# Altium schematic sheet 3_RF.SchDoc
size 420 x 297 mm; SheetNumber: 3; SheetTotal: 3; Rozrobyv: Іванченко; Pereviryv: {Перевірив}; Tkontr: {Т.контр}; Nkontr: {Н. контр.}; Zatverdyv: {Затвердив}; Oboznachennia: РІ91.468789.001 Е3; Naymenuvannya: Генератор прямого; Naymenuvannya2: цифрового синтезу; MisceVudannya: НТУУ КПІ, РТФ, РІ91; Naymenuvannya3: Схема електрична принципова; Sheet: 3
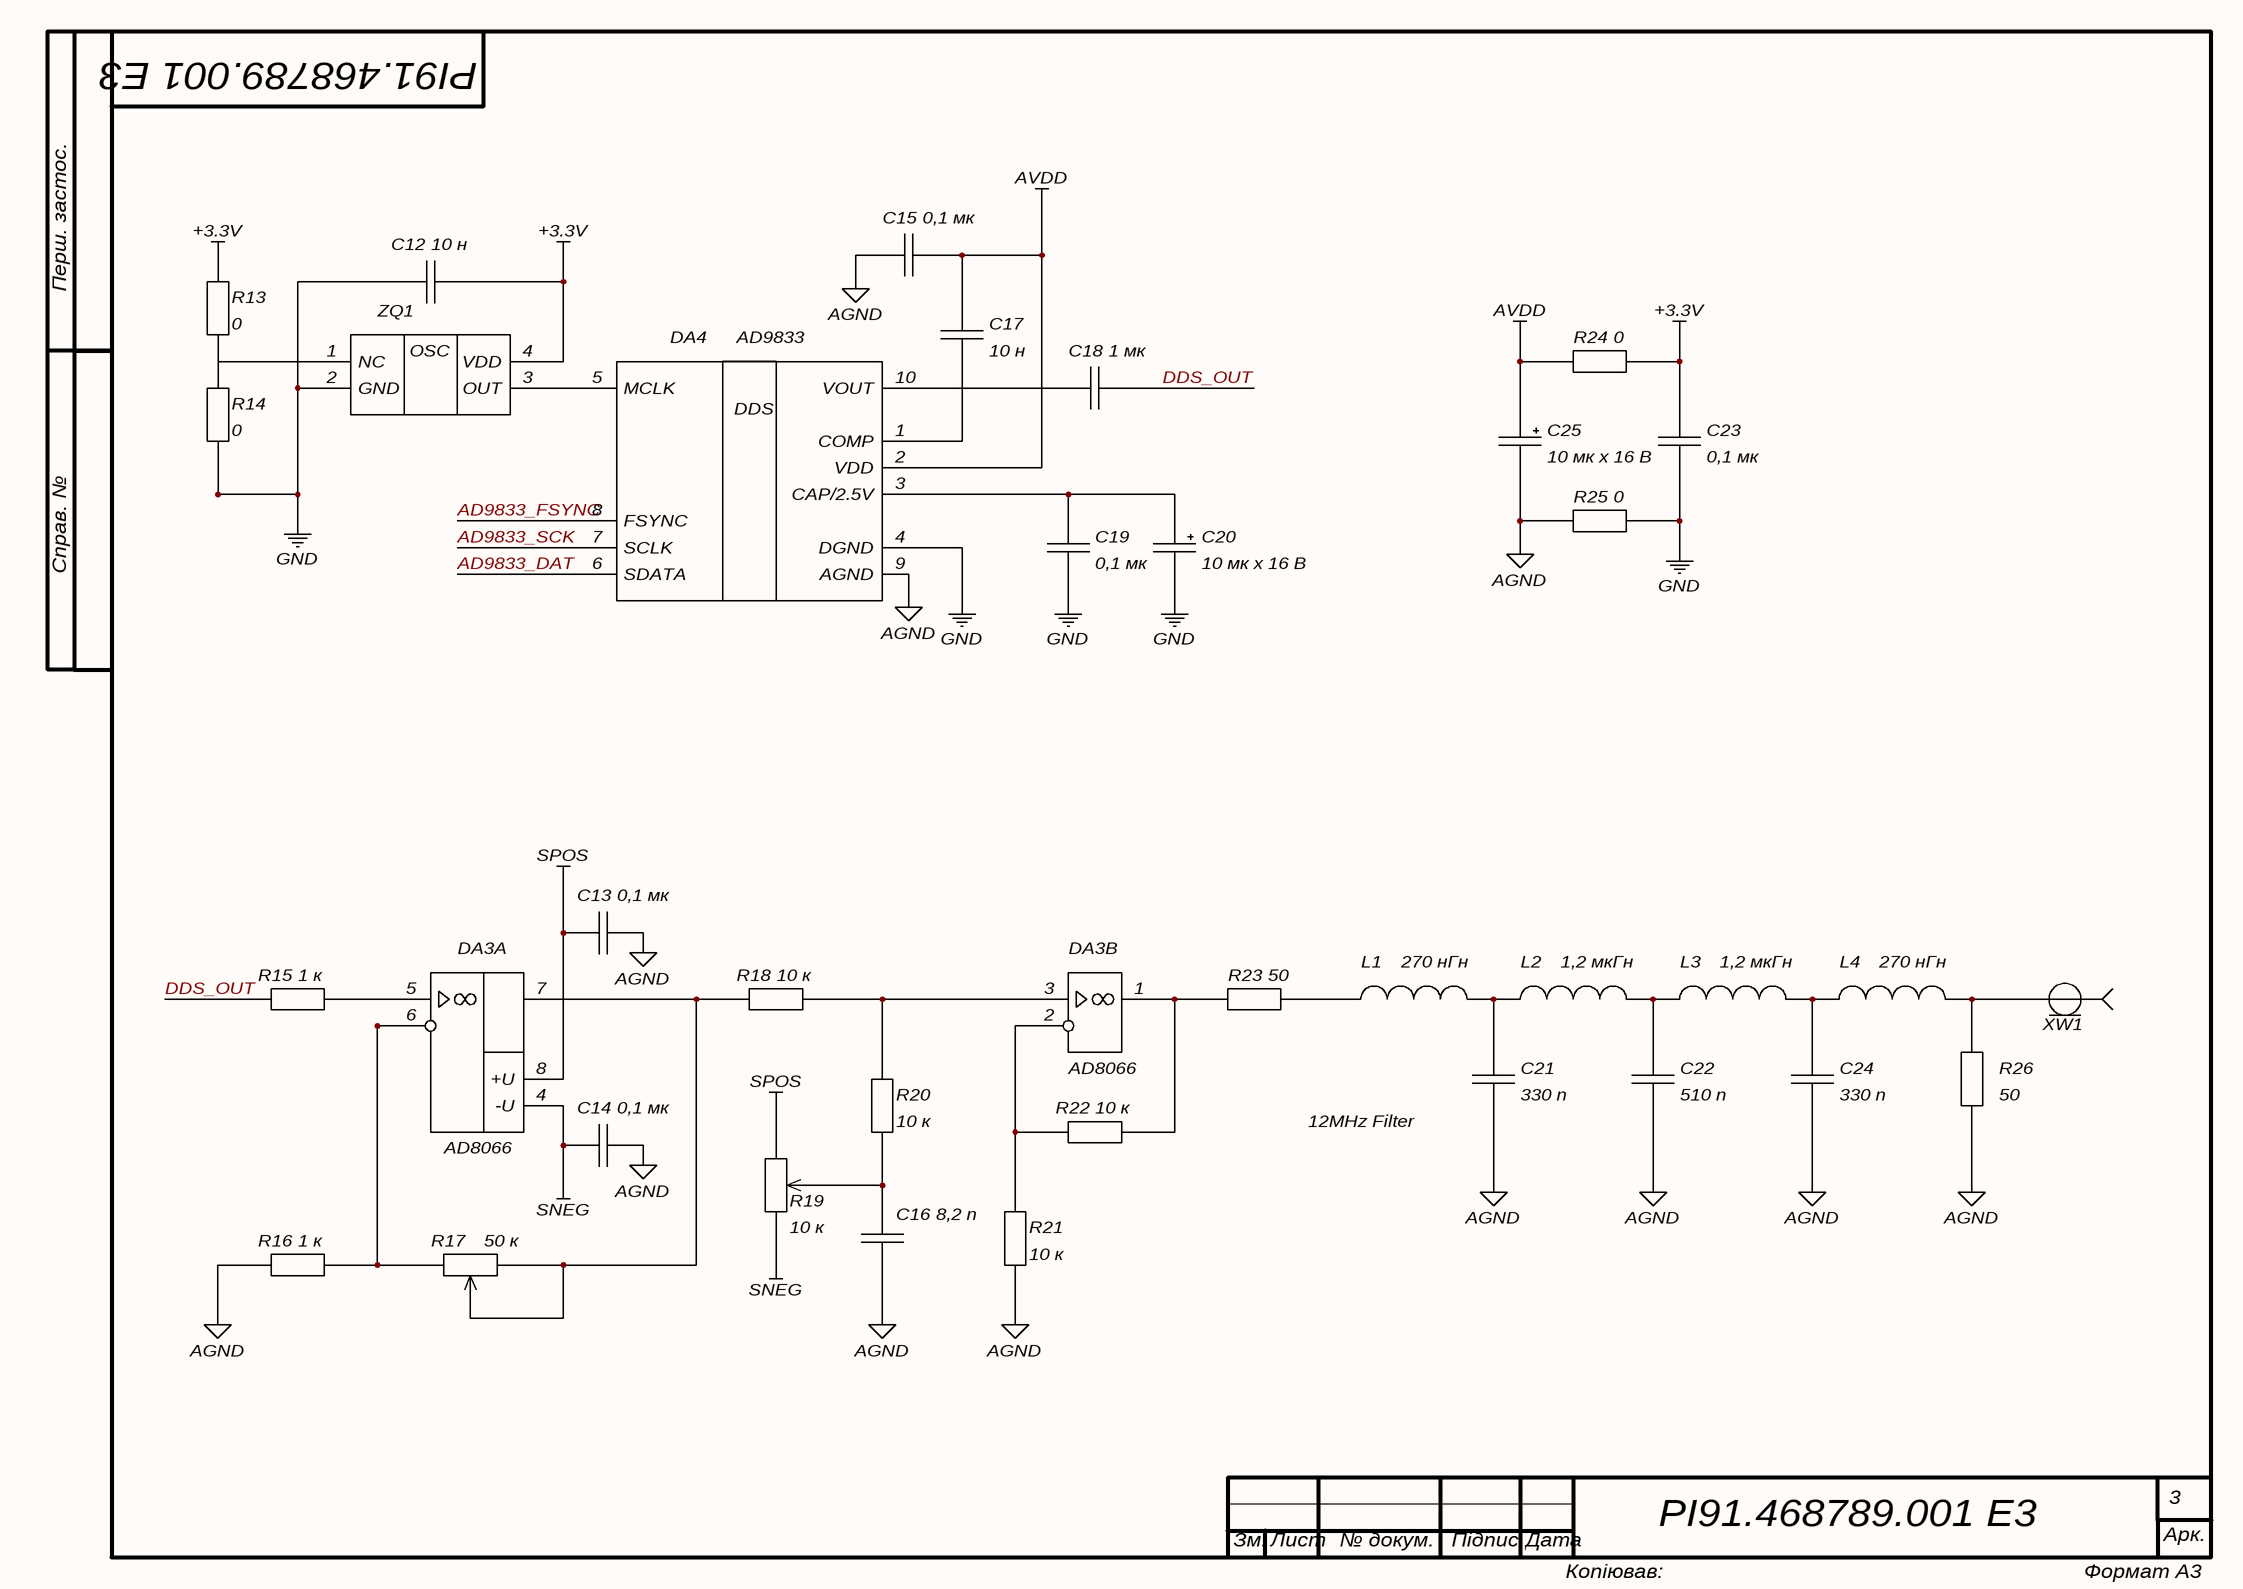
[diagram p0: 3_RF.SchDoc]

## Parts
C12  10n  [CAP: 0603]  (value not drawn)
C13  0.1u  [CAP: 0603]  (value not drawn)
C14  0.1u  [CAP: 0603]  (value not drawn)
C15  0.1u  [CAP: 0603]  (value not drawn)
C16  8.2p  [CAP: 0603]  (value not drawn)
C17  10n  [CAP: 0603]  (value not drawn)
C18  1u 50V  [CAP: 0805]  (value not drawn)
C19  0.1u  [CAP: 0603]  (value not drawn)
C20  10 16: 10 мк х 16 В  [CAP: TANTAL-A]  (hidden comment: 10u 16V)
C21  330p  [CAP: 0805]  (value not drawn)
C22  510p  [CAP: 0805]  (value not drawn)
C23  0.1u  [CAP: 0603]  (value not drawn)
C24  330p  [CAP: 0805]  (value not drawn)
C25  10 16: 10 мк х 16 В  [CAP: TANTAL-A]  (hidden comment: 10u 16V)
DA3  AD8066  [8-SOIC]  (parts A,B of 2)
DA4  AD9833  [10-MSOP]
L1  270n: 270 нГн  [IND: 0805]  (hidden comment: 270nH)
L2  1.2: 1,2 мкГн  [IND: 0805]  (hidden comment: 1.2uH)
L3  1.2: 1,2 мкГн  [IND: 0805]  (hidden comment: 1.2uH)
L4  270n: 270 нГн  [IND: 0805]  (hidden comment: 270nH)
R13  0  [RES: 0603]
R14  0  [RES: 0603]
R15  1k  [RES: 0805]  (value not drawn)
R16  1k  [RES: 0805]  (value not drawn)
R17  50: 50 к  [RES: PTV09A-4015F]  (hidden comment: 10k)
R18  10k  [RES: 0805]  (value not drawn)
R19  10: 10 к  [RES: PTV09A-4015F]  (hidden comment: 10k)
R20  10k  [RES: 0805]  (value not drawn)
R21  10k  [RES: 0805]  (value not drawn)
R22  10k  [RES: 0805]  (value not drawn)
R23  50  [RES: 0805]
R24  0  [RES: 0603]  (net tie, no BOM)
R25  0  [RES: 0603]  (net tie, no BOM)
R26  50  [RES: 0805]
XW1  SMA Edge  [CON: SMA EDGE MOUNT]  (value not drawn)
ZQ1  25 MHz  [OSC: 5070G]  (value not drawn)

## Nets
+3.3V: C12.2 C23.2 R13.2 R24.1 ZQ1.4(VDD)
AGND: C13.2 C14.2 C15.2 C16.1 C21.1 C22.1 C24.1 C25.2 DA4.9(AGND) R16.1 R21.1 R25.2 R26.1
AVDD: C15.1 C17.1 C25.1 DA4.2(VDD) R24.2
GND: C12.1 C19.1 C20.2 C23.1 DA4.4(DGND) R14.1 R25.1 ZQ1.2(GND)
SNEG: C14.1 DA3.4(-U) R19.3
SPOS: C13.1 DA3.8(+U) R19.1
AD9833_DAT: DA4.6(SDATA)
AD9833_FSYNC: DA4.8(FSYNC)
AD9833_SCK: DA4.7(SCLK)
DDS_OUT: C18.2 R15.1
NetC16_2: C16.2 R19.2 R20.1
NetC17_2: C17.2 DA4.1(COMP)
NetC18_1: C18.1 DA4.10(VOUT)
NetC19_2: C19.2 C20.1 DA4.3(CAP/2.5V)
NetC21_2: C21.2 L1.2 L2.1
NetC22_2: C22.2 L2.2 L3.1
NetC24_2: C24.2 L3.2 L4.1
NetDA3_1: DA3.1(OUT2) R22.1 R23.2
NetDA3_2: DA3.2(-IN2) R21.2 R22.2
NetDA3_3: DA3.3(+IN2) R18.2 R20.2
NetDA3_5: DA3.5(+IN1) R15.2
NetDA3_6: DA3.6(-IN1) R16.2 R17.3
NetDA3_7: DA3.7(OUT1) R17.1 R17.2 R18.1
NetDA4_5: DA4.5(MCLK) ZQ1.3(OUT)
NetL1_1: L1.1 R23.1
NetL4_2: L4.2 R26.2 XW1.1(SIG)
NetR13_1: R13.1 R14.2 ZQ1.1(NC)

## Notes on the sheet
- 12MHz Filter
- Перш. застос.
- Справ. №
- Арк.
- Зм.
- Лист
- № докум.
- Підпис
- Дата
- Копіював:
- Формат А3
- (in symbol AD9833) DDS
- (in symbol Oscillator) OSC

## Library data of the parts
C12-C19 C21-C24 = Capacitor: Non-polarity; 1 мк: 1 мк; 100 н: 100 н; 470 н: 470 н; 8,2 п: 8,2 п; 0,1 мк: 0,1 мк; 10 н: 10 н; 180 п: 180 п; 300 п: 300 п; 330 п: 330 п; 510 п: 510 п; 270 п: 270 п
C20 C25 = Capacitor_polar: Polarity; 470 6,3: 470 мк х 6,3 В; 2200 35: 2200 мк x 35 В; 100 16: 100 мк х 16 В; 0.1 400: 0,1 мк х 400 В; 2.2 16: 2,2 мк х 16 В; 1 16: 1 мк х 16 В; 47 50: 47 мк х 50 В; 47 10: 47 мк х 10 В
DA3 = Op Amp: ComponentLink1Description: Datasheet; ComponentLink1URL: https://www.analog.com/media/en/technical-documentation/data-sheets/AD8065_8066.pdf; LM358: LM358; AD8066: AD8066
DA4 = AD9833: DDS Generator; ComponentLink1Description: Datasheet; ComponentLink1URL: https://www.analog.com/media/en/technical-documentation/data-sheets/ad9833.pdf
L1 L4 = Inductor: 1.2: 1,2 мкГн; 330n: 330 нГн
L2 L3 = Inductor: 330n: 330 нГн; 270n: 270 нГн
R13-R16 R18 R20-R26 = Resistor: 220: 220; 1 к: 1 к; 3,3 к: 3,3 к; 9,1 к: 9,1 к; 200: 200; 50: 50; 510 к: 510 к; 10 к: 10 к; 0: 0
R17 = Potentiometer: 10: 10 к
R19 = Potentiometer: 50: 50 к
XW1 = Connector RF
ZQ1 = Oscillator